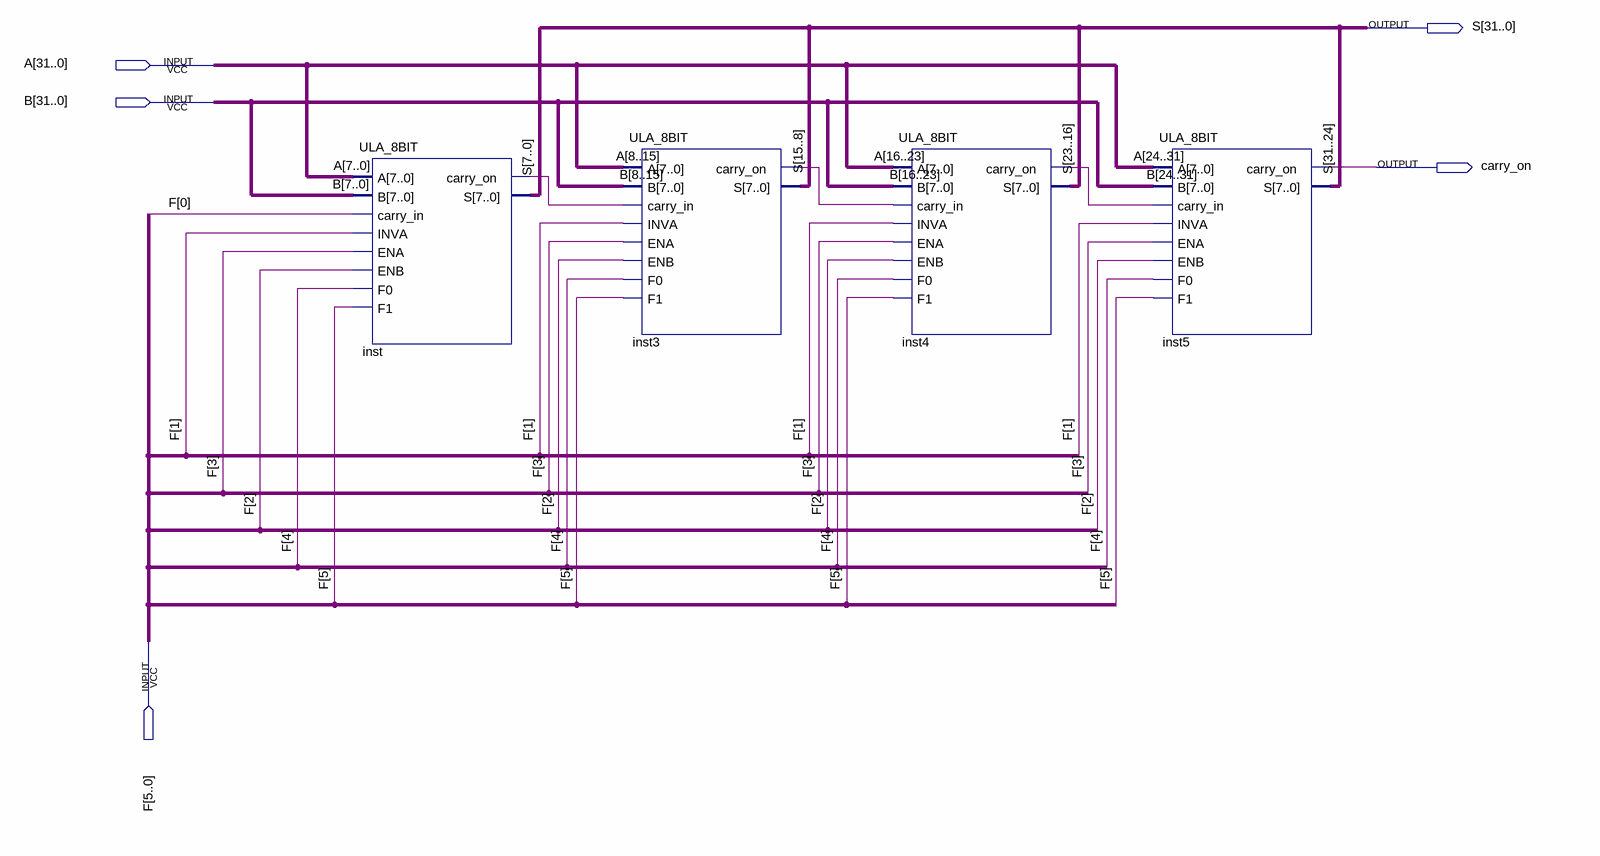
[diagram p0: schematic sheet]
// Quartus schematic ULA_32BIT.bdf as structural Verilog: 4 symbols, 5 pins
module ULA_32BIT (
  input  [31:0] A,
  input  [31:0] B,
  input  [5:0] F,
  output [31:0] S,
  output carry_on
);

  wire inst3_carry_on, inst4_carry_on, inst_carry_on;

  ULA_8BIT inst (
    .A(A[7:0]), .B(B[7:0]), .carry_in(F[0]), .INVA(F[1]), .ENA(F[3]), .ENB(F[2]), .F0(F[4]), .F1(F[5]),
    .carry_on(inst_carry_on), .S(S[7:0]));
  ULA_8BIT inst3 (
    .A({A[8], A[9], A[10], A[11], A[12], A[13], A[14], A[15]}),
    .B({B[8], B[9], B[10], B[11], B[12], B[13], B[14], B[15]}), .carry_in(inst_carry_on), .INVA(F[1]),
    .ENA(F[3]), .ENB(F[2]), .F0(F[4]), .F1(F[5]), .carry_on(inst3_carry_on), .S(S[15:8]));
  ULA_8BIT inst4 (
    .A({A[16], A[17], A[18], A[19], A[20], A[21], A[22], A[23]}),
    .B({B[16], B[17], B[18], B[19], B[20], B[21], B[22], B[23]}), .carry_in(inst3_carry_on), .INVA(F[1]),
    .ENA(F[3]), .ENB(F[2]), .F0(F[4]), .F1(F[5]), .carry_on(inst4_carry_on), .S(S[23:16]));
  ULA_8BIT inst5 (
    .A({A[24], A[25], A[26], A[27], A[28], A[29], A[30], A[31]}),
    .B({B[24], B[25], B[26], B[27], B[28], B[29], B[30], B[31]}), .carry_in(inst4_carry_on), .INVA(F[1]),
    .ENA(F[3]), .ENB(F[2]), .F0(F[4]), .F1(F[5]), .carry_on(carry_on), .S(S[31:24]));
endmodule
